# Altium schematic sheet CONTROLADOR-V1-RELES.SchDoc
size A4
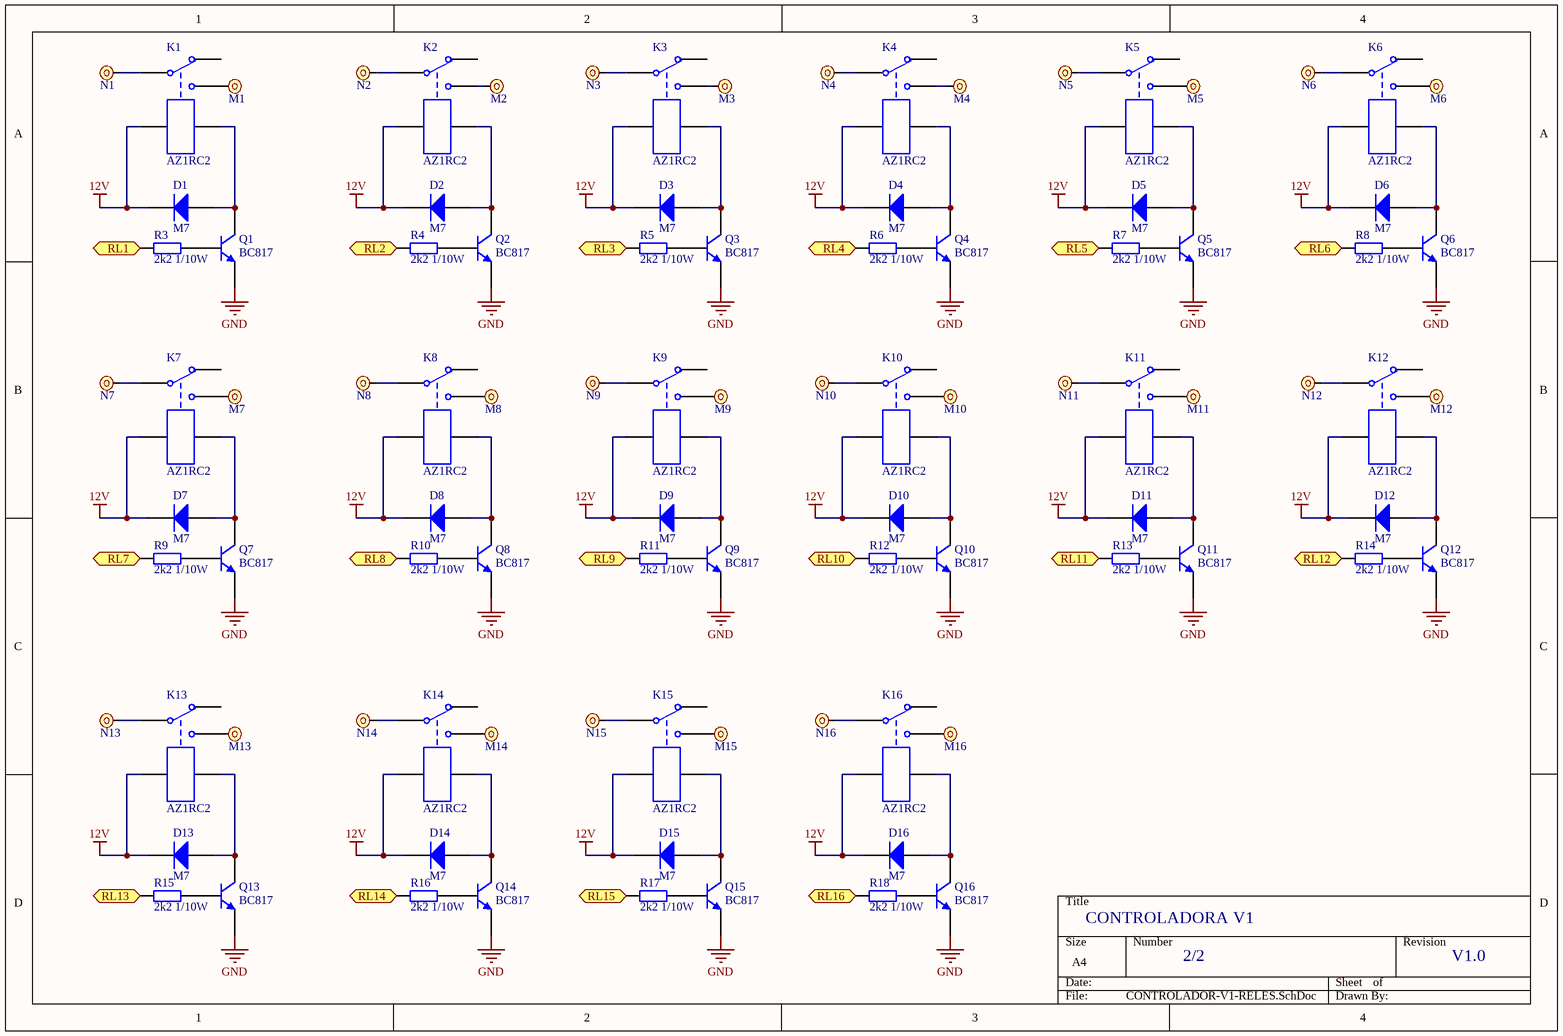
[diagram p0: CONTROLADOR-V1-RELES.SchDoc]

## Parts
D1  M7  [DO-214AC - SMA]
D2  M7  [DO-214AC - SMA]
D3  M7  [DO-214AC - SMA]
D4  M7  [DO-214AC - SMA]
D5  M7  [DO-214AC - SMA]
D6  M7  [DO-214AC - SMA]
D7  M7  [DO-214AC - SMA]
D8  M7  [DO-214AC - SMA]
D9  M7  [DO-214AC - SMA]
D10  M7  [DO-214AC - SMA]
D11  M7  [DO-214AC - SMA]
D12  M7  [DO-214AC - SMA]
D13  M7  [DO-214AC - SMA]
D14  M7  [DO-214AC - SMA]
D15  M7  [DO-214AC - SMA]
D16  M7  [DO-214AC - SMA]
K1  AZ1RC2  [RELE SPDT]
K2  AZ1RC2  [RELE SPDT]
K3  AZ1RC2  [RELE SPDT]
K4  AZ1RC2  [RELE SPDT]
K5  AZ1RC2  [RELE SPDT]
K6  AZ1RC2  [RELE SPDT]
K7  AZ1RC2  [RELE SPDT]
K8  AZ1RC2  [RELE SPDT]
K9  AZ1RC2  [RELE SPDT]
K10  AZ1RC2  [RELE SPDT]
K11  AZ1RC2  [RELE SPDT]
K12  AZ1RC2  [RELE SPDT]
K13  AZ1RC2  [RELE SPDT]
K14  AZ1RC2  [RELE SPDT]
K15  AZ1RC2  [RELE SPDT]
K16  AZ1RC2  [RELE SPDT]
M1  PAD 1.5x3mm  [PAD 1.5x3mm]  (value not drawn)  (no BOM)
M2  PAD 1.5x3mm  [PAD 1.5x3mm]  (value not drawn)  (no BOM)
M3  PAD 1.5x3mm  [PAD 1.5x3mm]  (value not drawn)  (no BOM)
M4  PAD 1.5x3mm  [PAD 1.5x3mm]  (value not drawn)  (no BOM)
M5  PAD 1.5x3mm  [PAD 1.5x3mm]  (value not drawn)  (no BOM)
M6  PAD 1.5x3mm  [PAD 1.5x3mm]  (value not drawn)  (no BOM)
M7  PAD 1.5x3mm  [PAD 1.5x3mm]  (value not drawn)  (no BOM)
M8  PAD 1.5x3mm  [PAD 1.5x3mm]  (value not drawn)  (no BOM)
M9  PAD 1.5x3mm  [PAD 1.5x3mm]  (value not drawn)  (no BOM)
M10  PAD 1.5x3mm  [PAD 1.5x3mm]  (value not drawn)  (no BOM)
M11  PAD 1.5x3mm  [PAD 1.5x3mm]  (value not drawn)  (no BOM)
M12  PAD 1.5x3mm  [PAD 1.5x3mm]  (value not drawn)  (no BOM)
M13  PAD 1.5x3mm  [PAD 1.5x3mm]  (value not drawn)  (no BOM)
M14  PAD 1.5x3mm  [PAD 1.5x3mm]  (value not drawn)  (no BOM)
M15  PAD 1.5x3mm  [PAD 1.5x3mm]  (value not drawn)  (no BOM)
M16  PAD 1.5x3mm  [PAD 1.5x3mm]  (value not drawn)  (no BOM)
N1  PAD 1.5x3mm  [PAD 1.5x3mm]  (value not drawn)  (no BOM)
N2  PAD 1.5x3mm  [PAD 1.5x3mm]  (value not drawn)  (no BOM)
N3  PAD 1.5x3mm  [PAD 1.5x3mm]  (value not drawn)  (no BOM)
N4  PAD 1.5x3mm  [PAD 1.5x3mm]  (value not drawn)  (no BOM)
N5  PAD 1.5x3mm  [PAD 1.5x3mm]  (value not drawn)  (no BOM)
N6  PAD 1.5x3mm  [PAD 1.5x3mm]  (value not drawn)  (no BOM)
N7  PAD 1.5x3mm  [PAD 1.5x3mm]  (value not drawn)  (no BOM)
N8  PAD 1.5x3mm  [PAD 1.5x3mm]  (value not drawn)  (no BOM)
N9  PAD 1.5x3mm  [PAD 1.5x3mm]  (value not drawn)  (no BOM)
N10  PAD 1.5x3mm  [PAD 1.5x3mm]  (value not drawn)  (no BOM)
N11  PAD 1.5x3mm  [PAD 1.5x3mm]  (value not drawn)  (no BOM)
N12  PAD 1.5x3mm  [PAD 1.5x3mm]  (value not drawn)  (no BOM)
N13  PAD 1.5x3mm  [PAD 1.5x3mm]  (value not drawn)  (no BOM)
N14  PAD 1.5x3mm  [PAD 1.5x3mm]  (value not drawn)  (no BOM)
N15  PAD 1.5x3mm  [PAD 1.5x3mm]  (value not drawn)  (no BOM)
N16  PAD 1.5x3mm  [PAD 1.5x3mm]  (value not drawn)  (no BOM)
Q1  BC817  [SOT23-3N]
Q2  BC817  [SOT23-3N]
Q3  BC817  [SOT23-3N]
Q4  BC817  [SOT23-3N]
Q5  BC817  [SOT23-3N]
Q6  BC817  [SOT23-3N]
Q7  BC817  [SOT23-3N]
Q8  BC817  [SOT23-3N]
Q9  BC817  [SOT23-3N]
Q10  BC817  [SOT23-3N]
Q11  BC817  [SOT23-3N]
Q12  BC817  [SOT23-3N]
Q13  BC817  [SOT23-3N]
Q14  BC817  [SOT23-3N]
Q15  BC817  [SOT23-3N]
Q16  BC817  [SOT23-3N]
R3  2k2 1/10W  [RESC0603N]
R4  2k2 1/10W  [RESC0603N]
R5  2k2 1/10W  [RESC0603N]
R6  2k2 1/10W  [RESC0603N]
R7  2k2 1/10W  [RESC0603N]
R8  2k2 1/10W  [RESC0603N]
R9  2k2 1/10W  [RESC0603N]
R10  2k2 1/10W  [RESC0603N]
R11  2k2 1/10W  [RESC0603N]
R12  2k2 1/10W  [RESC0603N]
R13  2k2 1/10W  [RESC0603N]
R14  2k2 1/10W  [RESC0603N]
R15  2k2 1/10W  [RESC0603N]
R16  2k2 1/10W  [RESC0603N]
R17  2k2 1/10W  [RESC0603N]
R18  2k2 1/10W  [RESC0603N]

## Ports
RL1, RL2, RL3, RL4, RL5, RL6, RL7, RL8, RL9, RL10, RL11, RL12, RL13, RL14, RL15, RL16

## Nets
12V: D1.1(K) D2.1(K) D3.1(K) D4.1(K) D5.1(K) D6.1(K) D7.1(K) D8.1(K) D9.1(K) D10.1(K) D11.1(K) D12.1(K) D13.1(K) D14.1(K) D15.1(K) D16.1(K) K1.4 K2.4 K3.4 K4.4 K5.4 K6.4 K7.4 K8.4 K9.4 K10.4 K11.4 K12.4 K13.4 K14.4 K15.4 K16.4
GND: Q1.2(E) Q2.2(E) Q3.2(E) Q4.2(E) Q5.2(E) Q6.2(E) Q7.2(E) Q8.2(E) Q9.2(E) Q10.2(E) Q11.2(E) Q12.2(E) Q13.2(E) Q14.2(E) Q15.2(E) Q16.2(E)
RL1: R3.1 ; port RL1
RL2: R4.1 ; port RL2
RL3: R5.1 ; port RL3
RL4: R6.1 ; port RL4
RL5: R7.1 ; port RL5
RL6: R8.1 ; port RL6
RL7: R9.1 ; port RL7
RL8: R10.1 ; port RL8
RL9: R11.1 ; port RL9
RL10: R12.1 ; port RL10
RL11: R13.1 ; port RL11
RL12: R14.1 ; port RL12
RL13: R15.1 ; port RL13
RL14: R16.1 ; port RL14
RL15: R17.1 ; port RL15
RL16: R18.1 ; port RL16
NetD1_2: D1.2(A) K1.5 Q1.3(C)
NetD2_2: D2.2(A) K2.5 Q2.3(C)
NetD3_2: D3.2(A) K3.5 Q3.3(C)
NetD4_2: D4.2(A) K4.5 Q4.3(C)
NetD5_2: D5.2(A) K5.5 Q5.3(C)
NetD6_2: D6.2(A) K6.5 Q6.3(C)
NetD7_2: D7.2(A) K7.5 Q7.3(C)
NetD8_2: D8.2(A) K8.5 Q8.3(C)
NetD9_2: D9.2(A) K9.5 Q9.3(C)
NetD10_2: D10.2(A) K10.5 Q10.3(C)
NetD11_2: D11.2(A) K11.5 Q11.3(C)
NetD12_2: D12.2(A) K12.5 Q12.3(C)
NetD13_2: D13.2(A) K13.5 Q13.3(C)
NetD14_2: D14.2(A) K14.5 Q14.3(C)
NetD15_2: D15.2(A) K15.5 Q15.3(C)
NetD16_2: D16.2(A) K16.5 Q16.3(C)
NetK1_1: K1.1(Comum) N1.1
NetK1_2: K1.2(N.A.) M1.1
NetK2_1: K2.1(Comum) N2.1
NetK2_2: K2.2(N.A.) M2.1
NetK3_1: K3.1(Comum) N3.1
NetK3_2: K3.2(N.A.) M3.1
NetK4_1: K4.1(Comum) N4.1
NetK4_2: K4.2(N.A.) M4.1
NetK5_1: K5.1(Comum) N5.1
NetK5_2: K5.2(N.A.) M5.1
NetK6_1: K6.1(Comum) N6.1
NetK6_2: K6.2(N.A.) M6.1
NetK7_1: K7.1(Comum) N7.1
NetK7_2: K7.2(N.A.) M7.1
NetK8_1: K8.1(Comum) N8.1
NetK8_2: K8.2(N.A.) M8.1
NetK9_1: K9.1(Comum) N9.1
NetK9_2: K9.2(N.A.) M9.1
NetK10_1: K10.1(Comum) N10.1
NetK10_2: K10.2(N.A.) M10.1
NetK11_1: K11.1(Comum) N11.1
NetK11_2: K11.2(N.A.) M11.1
NetK12_1: K12.1(Comum) N12.1
NetK12_2: K12.2(N.A.) M12.1
NetK13_1: K13.1(Comum) N13.1
NetK13_2: K13.2(N.A.) M13.1
NetK14_1: K14.1(Comum) N14.1
NetK14_2: K14.2(N.A.) M14.1
NetK15_1: K15.1(Comum) N15.1
NetK15_2: K15.2(N.A.) M15.1
NetK16_1: K16.1(Comum) N16.1
NetK16_2: K16.2(N.A.) M16.1
NetQ1_1: Q1.1(B) R3.2
NetQ2_1: Q2.1(B) R4.2
NetQ3_1: Q3.1(B) R5.2
NetQ4_1: Q4.1(B) R6.2
NetQ5_1: Q5.1(B) R7.2
NetQ6_1: Q6.1(B) R8.2
NetQ7_1: Q7.1(B) R9.2
NetQ8_1: Q8.1(B) R10.2
NetQ9_1: Q9.1(B) R11.2
NetQ10_1: Q10.1(B) R12.2
NetQ11_1: Q11.1(B) R13.2
NetQ12_1: Q12.1(B) R14.2
NetQ13_1: Q13.1(B) R15.2
NetQ14_1: Q14.1(B) R16.2
NetQ15_1: Q15.1(B) R17.2
NetQ16_1: Q16.1(B) R18.2

Not connected (* = marked no-connect by the designer): K1 3(N.F.); K2 3(N.F.); K3 3(N.F.); K4 3(N.F.); K5 3(N.F.); K6 3(N.F.); K7 3(N.F.); K8 3(N.F.); K9 3(N.F.); K10 3(N.F.); K11 3(N.F.); K12 3(N.F.); K13 3(N.F.); K14 3(N.F.); K15 3(N.F.); K16 3(N.F.)

## Notes on the sheet
- CONTROLADORA V1
- 2/2
- V1.0

## Library data of the parts
D1-D16 = Diodo M7: DIODE GEN PURP 1KV 1A DO214AC; Manufacturer: Kingtronics; Diode Type: Standard; Voltage - DC Reverse (Vr) (Max): 1000V (1kV); Voltage - Forward (Vf) (Max) @ If: 1V @ 1A; Speed: Standard Recovery >500ns, > 200mA (Io); Current - Reverse Leakage @ Vr: 10µA @ 1000V; Capacitance @ Vr, F: 15pF @ 4V, 1MHz; Código: 2412; Montagem: SMD; Supplier 1: Digi-Key; Supplier Part Number 1: GS1M-LTPMSCT-ND; Manufacturer Part Number: M7; RoHS: RoHS Compliant; Category: Discrete Semiconductor Products; Stock 1: 30717; Pricing 1: 1=0.28, 10=0.258, 25=0.1856, 100=0.1442, 250=0.09064, 500=0.07726, 1000=0.05253, 2500=0.04738 (USD); Packaging: Cut Tape (CT); Part Status: Active; Current - Average Rectified (Io): 1A; Mounting Type: Surface Mount; Package / Case: DO-214AC, SMA; Supplier Device Package: DO-214AC (SMA); Operating Temperature - Junction: -55°C ~ 150°C; ComponentLink1URL: http://www.kingtronics.com/pdf/M7-diode.pdf; ComponentLink1Description: http://www.kingtronics.com/pdf/M7-diode.pdf
K1-K16 = Rele AZ1RC2: RELAY GEN PURPOSE SPDT 10A 12V; Manufacturer: Metaltex; Relay Type: General Purpose; Coil Type: Non Latching; Coil Voltage: 12VDC; Contact Form: SPDT (1 Form C); Switching Voltage: 250VAC, 30VDC - Max; Turn On Voltage (Max): 9 VDC; Turn Off Voltage (Min): 1.2 VDC; Coil Power: 360 mW; Coil Resistance: 400 Ohms; Montagem: PTH; Código: 2567; Supplier 1: Digi-Key; Supplier Part Number 1: Z1012-ND; Manufacturer Part Number: AZ1RC2; RoHS: RoHS Compliant; Category: Relays; Stock 1: 37370; Pricing 1: 1=1.33, 10=1.247, 25=1.108, 50=1.0526, 100=0.9972, 250=0.8864, 500=0.831 (USD); Packaging: Tray; Part Status: Active; Mounting Type: Through Hole; Termination Style: PC Pin; Contact Material: Silver Tin Oxide (AgSnO); Operating Temperature: -40°C ~ 85°C; ComponentLink1URL: http://www.metaltex.com.br/downloads/AZ.pdf; ComponentLink1Description: http://www.metaltex.com.br/downloads/AZ.pdf
M1-M16 N1-N16 = PAD 1.5x3mm: PAD
Q1-Q16 = Transistor NPN BC817: TRANS NPN 45V 0.5A SOT23; Manufacturer: ON Semiconductor; Manufacturer Part Number: BC817-25LT1G; Current - Collector (Ic) (Max): 500mA; Vce Saturation (Max) @ Ib, Ic: 700mV @ 50mA, 500mA; Current - Collector Cutoff (Max): 100nA (ICBO); DC Current Gain (hFE) (Min) @ Ic, Vce: 160 @ 100mA, 1V; Power - Max: 300mW; Frequency - Transition: 100MHz; Montagem: SMD; Código: 1795; Supplier 1: Digi-Key; Supplier Part Number 1: BC817-25LT1GOSCT-ND; RoHS: RoHS Compliant; Category: Discrete Semiconductor Products; Stock 1: 101484; Pricing 1: 1=0.12, 10=0.109, 100=0.0594, 500=0.03654, 1000=0.02492 (USD); Packaging: Cut Tape (CT); Part Status: Active; Transistor Type: NPN; Voltage - Collector Emitter Breakdown (Max): 45V; Operating Temperature: -65°C ~ 150°C (TJ); Mounting Type: Surface Mount; Package / Case: TO-236-3, SC-59, SOT-23-3; Supplier Device Package: SOT-23-3 (TO-236); ComponentLink1URL: http://www.onsemi.com/pub_link/Collateral/BC817-16LT1-D.PDF; ComponentLink1Description: http://www.onsemi.com/pub_link/Collateral/BC817-16LT1-D.PDF
R3-R18 = Res 2k2 1/10W 5% 0603: RES SMD 2.2K OHM 5% 1/10W 0603; Manufacturer: Stackpole Electronics Inc.; Manufacturer Part Number: RMCF0603JT2K20; Código: 1850; Power (Watts): 0.1W, 1/10W; Temperature Coefficient: ±200ppm/°C; Montagem: SMD; Supplier 1: Digi-Key; Supplier Part Number 1: RMCF0603JT2K20CT-ND; RoHS: RoHS Compliant; Category: Resistors; Stock 1: 224282; Pricing 1: 1=0.1, 10=0.013, 100=0.0054, 1000=0.00242, 2500=0.0021 (USD); Packaging: Cut Tape (CT); Part Status: Active; Tolerance: ±5%; Composition: Thick Film; Features: Automotive AEC-Q200; Operating Temperature: -55°C ~ 155°C; Package / Case: 0603 (1608 Metric); Supplier Device Package: 0603; Size / Dimension: 0.061" L x 0.031" W (1.55mm x 0.80mm); Height - Seated (Max): 0.022" (0.55mm); Failure Rate: -; ComponentLink1URL: https://www.seielect.com/Catalog/SEI-RMCF_RMCP.pdf; ComponentLink1Description: https://www.seielect.com/Catalog/SEI-RMCF_RMCP.pdf